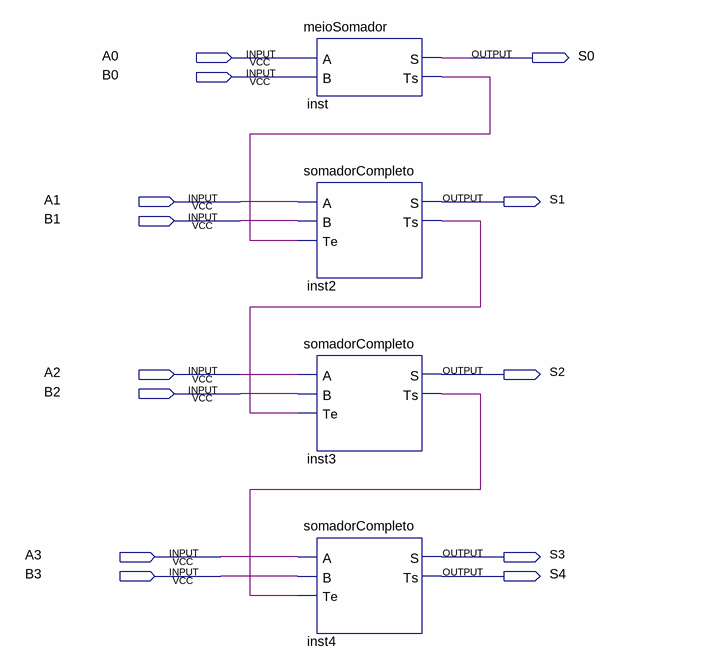
[diagram p0: schematic sheet]
// Quartus schematic sistema.bdf as structural Verilog: 4 symbols, 13 pins
module sistema (
  input  A0,
  input  B0,
  input  A1,
  input  B1,
  input  A2,
  input  B2,
  input  A3,
  input  B3,
  output S0,
  output S1,
  output S2,
  output S3,
  output S4
);

  wire inst2_ts, inst3_ts, inst_ts;

  meioSomador inst (.A(A0), .B(B0), .S(S0), .Ts(inst_ts));
  somadorCompleto inst2 (.A(A1), .B(B1), .Te(inst_ts), .S(S1), .Ts(inst2_ts));
  somadorCompleto inst3 (.A(A2), .B(B2), .Te(inst2_ts), .S(S2), .Ts(inst3_ts));
  somadorCompleto inst4 (.A(A3), .B(B3), .Te(inst3_ts), .S(S3), .Ts(S4));
endmodule
